# Altium schematic sheet Battery System.SchDoc
size A4; SheetNumber: 2; SheetTotal: 6
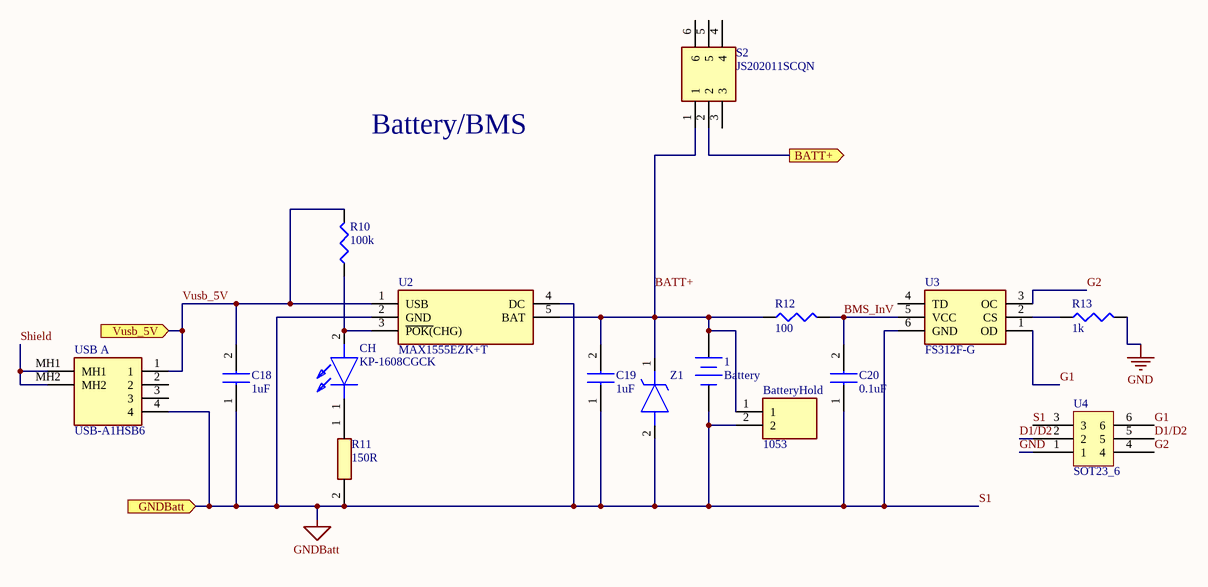
[diagram p0: Battery System.SchDoc]

## Parts
1  Battery  [BAT-2]
BatteryHold  1053  [1053]
C18  1uF  [CAPC1608X90N]
C19  1uF  [CAPC1608X90N]
C20  0.1uF  [CAPC3216X180N]
CH  KP-1608CGCK  [LEDC1608X120N]
R10  value 100k  [J1-0603]  (hidden comment: Res3)
R11  150R  [RESC1608X55N]
R12  value 100  [J1-0603]  (hidden comment: Res3)
R13  value 1k  [J1-0603]  (hidden comment: Res3)
S2  JS202011SCQN  [JS202011SCQN]
U2  MAX1555EZK+T  [SOT95P275X110-5N]
U3  FS312F-G  [SOT95P280X145-6N]
U4  SOT23_6  [SOT95P275X110-6N]
USB_A  USB-A1HSB6  [USBA1HSB6]
Z1  PTZTFTE253.3B  [DIOM5026X220N]  (value not drawn)

## Ports
BATT+ (out), GNDBatt (in), Vusb_5V (in)

## Nets
GND: R13.2 U4.1
S1: 1.2(-) BatteryHold.2 C18.1 C19.1 C20.1 R11.2 U2.2(GND) U2.4(DC) U3.6(GND) U4.3 USB_A.4 Z1.2(A) ; port GNDBatt  [also labelled GNDBatt]
BATT+: 1.1(+) BatteryHold.1 C19.2 R12.1 S2.1 U2.5(BAT) Z1.1(K)
BATT+: S2.2 ; port BATT+  [a separate net that carries the same name]
BMS_InV: C20.2 R12.2 U3.5(VCC)
D1/D2: U4.2 U4.5
G1: U3.1(OD) U4.6
G2: U3.3(OC) U4.4
Shield: USB_A.MH1 USB_A.MH2
Vusb_5V: C18.2 R10.2 U2.1(USB) USB_A.1 ; port Vusb_5V
NetCH_1: CH.1(K) R11.1
NetCH_2: CH.2(A) R10.1 U2.3(~{POK(}CHG))
NetR13_1: R13.1 U3.2(CS)

Not connected (* = marked no-connect by the designer): S2 3 4 5 6; U3 4(TD); USB_A 2 3

## Notes on the sheet
- Battery/BMS

## Library data of the parts
1 = Battery: Multicell Battery; Published: 24-Mar-1999; LatestRevisionDate: 17-Jul-2002; LatestRevisionNote: Re-released for DXP Platform.; PackageReference: BAT-2; Publisher: Altium Limited; PackageDescription: Battery; 2 Leads
BatteryHold = 1053: Undefined or Miscellaneous; Manufacturer_Name: Keystone Electronics; Datasheet Link: http://www.keyelco.com/product-pdf.cfm?p=751; Manufacturer_Part_Number: 1053; Mouser Part Number: 534-1053-BH; Mouser Price/Stock: https://www.mouser.co.uk/ProductDetail/Keystone-Electronics/1053?qs=%2F7TOpeL5Mz4zfgvqwo9sng%3D%3D; Arrow Part Number: 1053; Arrow Price/Stock: https://www.arrow.com/en/products/1053/keystone-electronics
C18 C19 = 0603YC105JAT2A: Capacitor, 0603YC10JAT2A; Manufacturer_Name: AVX; Datasheet Link: http://www.mouser.com/catalog/supplier/library/pdf/AVXSurfaceMountCeramic.pdf; Height: 0.9mm; Manufacturer_Part_Number: 0603YC105JAT2A; Mouser Part Number: 581-0603YC105JAT2A; Mouser Price/Stock: https://www.mouser.co.uk/ProductDetail/AVX/0603YC105JAT2A/?qs=RCLU9o6%252BptxSjO%252BNXwzoBQ%3D%3D; Arrow Part Number: 0603YC105JAT2A; Arrow Price/Stock: https://www.arrow.com/en/products/0603yc105jat2a/avx
C20 = GCM31C5C1H104FA16L: Capacitor, GCM31C5C1H104FA16L, 1206; Manufacturer_Name: Murata Electronics; Datasheet Link: https://www.digikey.in/product-detail/en/murata-electronics/GCM31C5C1H104FA16L/490-GCM31C5C1H104FA16LCT-ND/11618925; Height: 1.8mm; Manufacturer_Part_Number: GCM31C5C1H104FA16L; Mouser Part Number: 81-GCM31C5C1H104FA16; Mouser Price/Stock: https://www.mouser.co.uk/ProductDetail/Murata-Electronics/GCM31C5C1H104FA16L?qs=rrS6PyfT74fke0d0BEF0PA%3D%3D; Arrow Part Number: GCM31C5C1H104FA16L; Arrow Price/Stock: https://www.arrow.com/en/products/gcm31c5c1h104fa16l/murata-manufacturing
CH = KP-1608CGCK: LED; Manufacturer_Name: Kingbright; Datasheet Link: https://componentsearchengine.com/Datasheets/2/KP-1608CGCK.pdf; Height: 1.2mm; Manufacturer_Part_Number: KP-1608CGCK; Mouser Part Number: N/A; Mouser Price/Stock: https://www.mouser.co.uk/ProductDetail/Kingbright/KP-1608CGCK?qs=2JU0tDl2GZ3U0MYrqLedOQ%3D%3D; Arrow Part Number: KP-1608CGCK; Arrow Price/Stock: https://www.arrow.com/en/products/kp-1608cgck/kingbright?region=europe
R10 R12 R13 = Res3: Resistor; Published: 8-Jun-2000; LatestRevisionDate: 29-May-2009; LatestRevisionNote: IPC-7351 Footprint Added.; PackageReference: J1-0603; Publisher: Altium Limited; PackageDescription: Chip Resistor
R11 = CR0603-FX-1500ELF: Resistor, CR0603-FX-1500ELF; Manufacturer_Name: Bourns; Datasheet Link: https://www.bourns.com/pdfs/chpreztr.pdf; Height: 0.55mm; Manufacturer_Part_Number: CR0603-FX-1500ELF; Mouser Part Number: 652-CR0603FX-1500ELF; Mouser Price/Stock: https://www.mouser.co.uk/ProductDetail/Bourns/CR0603-FX-1500ELF?qs=e7cxVwPieupBDLrUX3Cc4g%3D%3D; Arrow Part Number: CR0603-FX-1500ELF; Arrow Price/Stock: https://www.arrow.com/en/products/cr0603-fx-1500elf/bourns?region=nac
S2 = JS202011SCQN: Switch; Manufacturer_Name: C & K COMPONENTS; Datasheet Link: http://www.ckswitches.com/media/1422/js.pdf; Height: 5.5mm; Manufacturer_Part_Number: JS202011SCQN; Mouser Part Number: 611-JS202011SCQN; Mouser Price/Stock: https://www.mouser.co.uk/ProductDetail/CK/JS202011SCQN?qs=LgMIjt8LuD95JYWxZ7NvZA%3D%3D; Arrow Part Number: JS202011SCQN; Arrow Price/Stock: https://www.arrow.com/en/products/js202011scqn/ck?region=nac
U2 = MAX1555EZK+T: Integrated Circuit; Manufacturer_Name: Maxim Integrated; Datasheet Link: http://datasheets.maximintegrated.com/en/ds/MAX1551-MAX1555.pdf; Height: 1.1mm; Manufacturer_Part_Number: MAX1555EZK+T; Mouser Part Number: 700-MAX1555EZK+T; Mouser Price/Stock: https://www.mouser.co.uk/ProductDetail/Maxim-Integrated/MAX1555EZK%2bT?qs=LHmEVA8xxfYLEoVKeceKJA%3D%3D; Arrow Part Number: MAX1555EZK+T; Arrow Price/Stock: https://www.arrow.com/en/products/max1555ezkt/maxim-integrated?region=nac
U3 = FS312F-G: Integrated Circuit; Manufacturer_Name: Fortune Semiconductor Corporation; Datasheet Link: https://www.ic-fortune.com/upload/Download/FS312F-G-DS-12_EN.pdf; Height: 1.45mm; Manufacturer_Part_Number: FS312F-G
USB_A = USB-A1HSB6: Connector; Manufacturer_Name: On Shore Technology Inc.; Datasheet Link: http://www.on-shore.com/wp-content/uploads/2015/09/usb-a1hsxx.pdf; Height: 7.1mm; Manufacturer_Part_Number: USB-A1HSB6
Z1 = PTZTFTE253.3B: Zener Diode; Manufacturer_Name: ROHM Semiconductor; Datasheet Link: https://fscdn.rohm.com/en/products/databook/datasheet/discrete/diode/zener/ptztfte252.2b-e.pdf; Height: 2.2mm; Manufacturer_Part_Number: PTZTFTE253.3B; Mouser Part Number: 755-PTZTFTE253.3B; Mouser Price/Stock: https://www.mouser.co.uk/ProductDetail/ROHM-Semiconductor/PTZTFTE253.3B?qs=4v%252BiZTmLVHEC5iicBmVMIQ%3D%3D